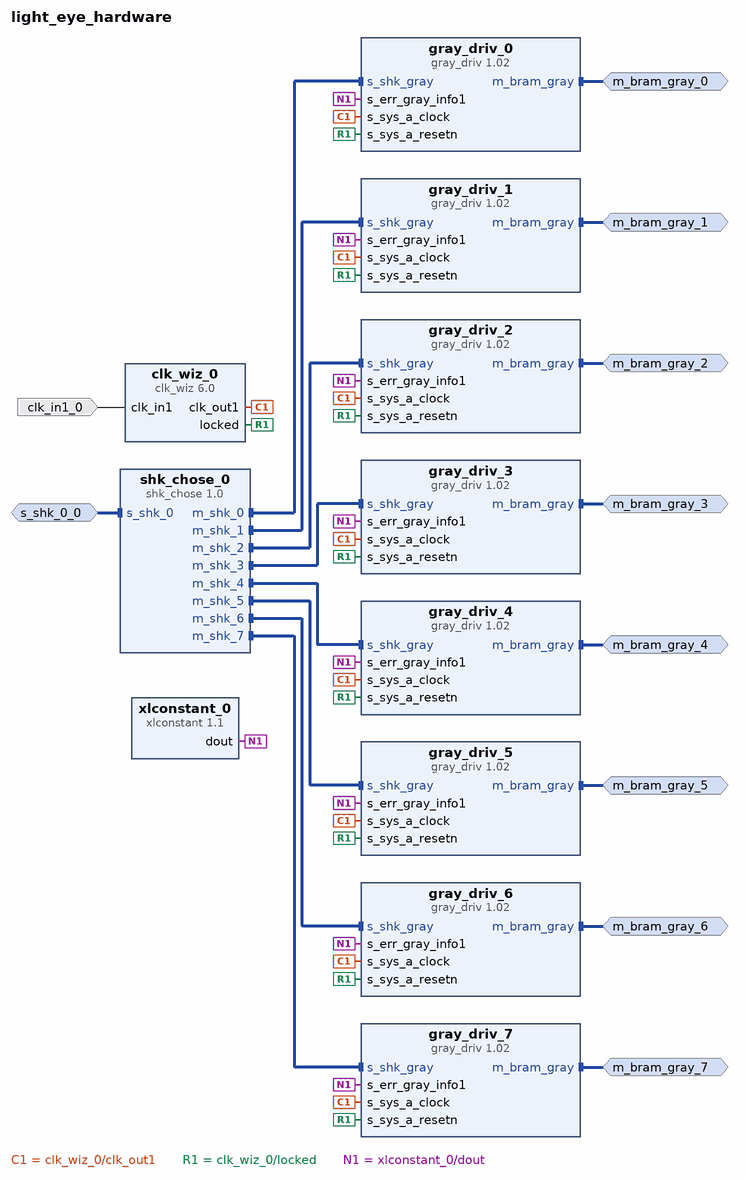
[diagram p0: block diagram of the top level]
# Vivado block design light_eye_hardware, xczu2cg-sfvc784-2-e, Vivado 2021.1
create_bd_design light_eye_hardware

create_bd_intf_port -mode Slave -vlnv fpgaPublish.com:user:SHK_rtl:1.0 s_shk_0_0
create_bd_intf_port -mode Master -vlnv xilinx.com:interface:bram_rtl:1.0 m_bram_gray_0
create_bd_intf_port -mode Master -vlnv xilinx.com:interface:bram_rtl:1.0 m_bram_gray_1
create_bd_intf_port -mode Master -vlnv xilinx.com:interface:bram_rtl:1.0 m_bram_gray_2
create_bd_intf_port -mode Master -vlnv xilinx.com:interface:bram_rtl:1.0 m_bram_gray_3
create_bd_intf_port -mode Master -vlnv xilinx.com:interface:bram_rtl:1.0 m_bram_gray_4
create_bd_intf_port -mode Master -vlnv xilinx.com:interface:bram_rtl:1.0 m_bram_gray_5
create_bd_intf_port -mode Master -vlnv xilinx.com:interface:bram_rtl:1.0 m_bram_gray_6
create_bd_intf_port -mode Master -vlnv xilinx.com:interface:bram_rtl:1.0 m_bram_gray_7
create_bd_port -dir I -type clk clk_in1_0
set_property -dict {CONFIG.FREQ_HZ 25000000} [get_bd_ports clk_in1_0]

create_bd_cell -type ip -vlnv xilinx.com:ip:clk_wiz:6.0 clk_wiz_0
set_property -dict [list \
  CONFIG.CLKIN1_JITTER_PS 400.0 \
  CONFIG.CLKOUT1_JITTER 190.517 \
  CONFIG.CLKOUT1_PHASE_ERROR 222.305 \
  CONFIG.MMCM_CLKFBOUT_MULT_F 48.000 \
  CONFIG.MMCM_CLKIN1_PERIOD 40.000 \
  CONFIG.MMCM_CLKIN2_PERIOD 10.0 \
  CONFIG.PRIM_IN_FREQ 25.000 \
  CONFIG.PRIM_SOURCE Global_buffer \
  CONFIG.USE_RESET false \
] [get_bd_cells clk_wiz_0]
create_bd_cell -type ip -vlnv xilinx.com:ip:xlconstant:1.1 xlconstant_0
set_property -dict {CONFIG.CONST_WIDTH 4} [get_bd_cells xlconstant_0]
create_bd_cell -type ip -vlnv fpgaPublish:user:shk_chose:1.0 shk_chose_0
create_bd_cell -type ip -vlnv fpgaPublish:user:gray_driv:1.02 gray_driv_0
create_bd_cell -type ip -vlnv fpgaPublish:user:gray_driv:1.02 gray_driv_1
create_bd_cell -type ip -vlnv fpgaPublish:user:gray_driv:1.02 gray_driv_2
create_bd_cell -type ip -vlnv fpgaPublish:user:gray_driv:1.02 gray_driv_3
create_bd_cell -type ip -vlnv fpgaPublish:user:gray_driv:1.02 gray_driv_4
create_bd_cell -type ip -vlnv fpgaPublish:user:gray_driv:1.02 gray_driv_5
create_bd_cell -type ip -vlnv fpgaPublish:user:gray_driv:1.02 gray_driv_6
create_bd_cell -type ip -vlnv fpgaPublish:user:gray_driv:1.02 gray_driv_7

# ---- connections ----

connect_bd_intf_net [get_bd_intf_ports m_bram_gray_0] [get_bd_intf_pins gray_driv_0/m_bram_gray]
connect_bd_intf_net [get_bd_intf_ports m_bram_gray_1] [get_bd_intf_pins gray_driv_1/m_bram_gray]
connect_bd_intf_net [get_bd_intf_ports m_bram_gray_2] [get_bd_intf_pins gray_driv_2/m_bram_gray]
connect_bd_intf_net [get_bd_intf_ports m_bram_gray_3] [get_bd_intf_pins gray_driv_3/m_bram_gray]
connect_bd_intf_net [get_bd_intf_ports m_bram_gray_4] [get_bd_intf_pins gray_driv_4/m_bram_gray]
connect_bd_intf_net [get_bd_intf_ports m_bram_gray_5] [get_bd_intf_pins gray_driv_5/m_bram_gray]
connect_bd_intf_net [get_bd_intf_ports m_bram_gray_6] [get_bd_intf_pins gray_driv_6/m_bram_gray]
connect_bd_intf_net [get_bd_intf_ports m_bram_gray_7] [get_bd_intf_pins gray_driv_7/m_bram_gray]
connect_bd_intf_net -intf_net s_shk_0_0_1 [get_bd_intf_ports s_shk_0_0] [get_bd_intf_pins shk_chose_0/s_shk_0]
connect_bd_intf_net [get_bd_intf_pins shk_chose_0/m_shk_0] [get_bd_intf_pins gray_driv_0/s_shk_gray]
connect_bd_intf_net [get_bd_intf_pins shk_chose_0/m_shk_1] [get_bd_intf_pins gray_driv_1/s_shk_gray]
connect_bd_intf_net [get_bd_intf_pins shk_chose_0/m_shk_2] [get_bd_intf_pins gray_driv_2/s_shk_gray]
connect_bd_intf_net [get_bd_intf_pins shk_chose_0/m_shk_3] [get_bd_intf_pins gray_driv_3/s_shk_gray]
connect_bd_intf_net [get_bd_intf_pins shk_chose_0/m_shk_4] [get_bd_intf_pins gray_driv_4/s_shk_gray]
connect_bd_intf_net [get_bd_intf_pins shk_chose_0/m_shk_5] [get_bd_intf_pins gray_driv_5/s_shk_gray]
connect_bd_intf_net [get_bd_intf_pins shk_chose_0/m_shk_6] [get_bd_intf_pins gray_driv_6/s_shk_gray]
connect_bd_intf_net [get_bd_intf_pins shk_chose_0/m_shk_7] [get_bd_intf_pins gray_driv_7/s_shk_gray]
connect_bd_net -net clk_in1_0_1 [get_bd_ports clk_in1_0] [get_bd_pins clk_wiz_0/clk_in1]
connect_bd_net [get_bd_pins clk_wiz_0/clk_out1] \
  [get_bd_pins gray_driv_0/s_sys_a_clock] [get_bd_pins gray_driv_1/s_sys_a_clock] [get_bd_pins gray_driv_2/s_sys_a_clock] \
  [get_bd_pins gray_driv_3/s_sys_a_clock] [get_bd_pins gray_driv_4/s_sys_a_clock] [get_bd_pins gray_driv_5/s_sys_a_clock] \
  [get_bd_pins gray_driv_6/s_sys_a_clock] [get_bd_pins gray_driv_7/s_sys_a_clock]
connect_bd_net [get_bd_pins clk_wiz_0/locked] \
  [get_bd_pins gray_driv_0/s_sys_a_resetn] [get_bd_pins gray_driv_1/s_sys_a_resetn] [get_bd_pins gray_driv_2/s_sys_a_resetn] \
  [get_bd_pins gray_driv_3/s_sys_a_resetn] [get_bd_pins gray_driv_4/s_sys_a_resetn] [get_bd_pins gray_driv_5/s_sys_a_resetn] \
  [get_bd_pins gray_driv_6/s_sys_a_resetn] [get_bd_pins gray_driv_7/s_sys_a_resetn]
connect_bd_net [get_bd_pins xlconstant_0/dout] \
  [get_bd_pins gray_driv_0/s_err_gray_info1] [get_bd_pins gray_driv_1/s_err_gray_info1] \
  [get_bd_pins gray_driv_2/s_err_gray_info1] [get_bd_pins gray_driv_3/s_err_gray_info1] \
  [get_bd_pins gray_driv_4/s_err_gray_info1] [get_bd_pins gray_driv_5/s_err_gray_info1] \
  [get_bd_pins gray_driv_6/s_err_gray_info1] [get_bd_pins gray_driv_7/s_err_gray_info1]

validate_bd_design
save_bd_design
